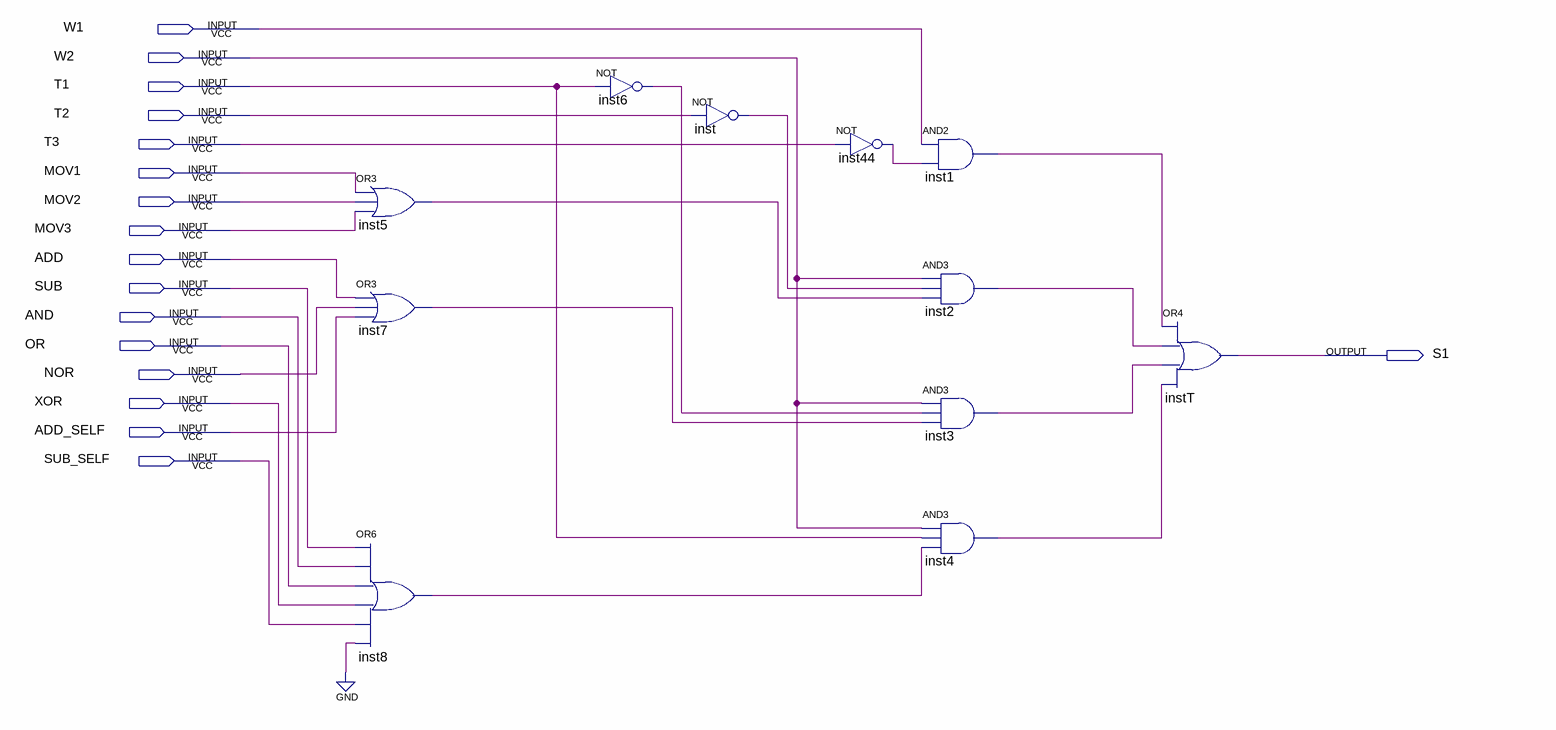
[diagram p0: schematic sheet]
// Quartus schematic S1.bdf as structural Verilog: 11 symbols, 17 pins
module S1 (
  input  W1,
  input  W2,
  input  T1,
  input  T2,
  input  T3,
  input  MOV1,
  input  MOV2,
  input  MOV3,
  input  ADD,
  input  SUB,
  input  AND,
  input  OR,
  input  NOR,
  input  XOR,
  input  ADD_SELF,
  input  SUB_SELF,
  output S1
);

  wire inst1_out, inst2_out, inst3_out, inst4_out, inst5_out, inst6_out, inst7_out, inst8_out, inst44_out,
       inst_out;

  or inst5 (inst5_out, MOV1, MOV2, MOV3);
  or inst7 (inst7_out, ADD, NOR, ADD_SELF);
  or inst8 (inst8_out, SUB, AND, OR, XOR, SUB_SELF, 1'b0);
  not inst6 (inst6_out, T1);
  not inst (inst_out, T2);
  not inst44 (inst44_out, T3);
  and inst1 (inst1_out, W1, inst44_out);
  and inst2 (inst2_out, W2, inst_out, inst5_out);
  and inst3 (inst3_out, W2, inst6_out, inst7_out);
  and inst4 (inst4_out, W2, T1, inst8_out);
  or instT (S1, inst1_out, inst2_out, inst3_out, inst4_out);
endmodule
